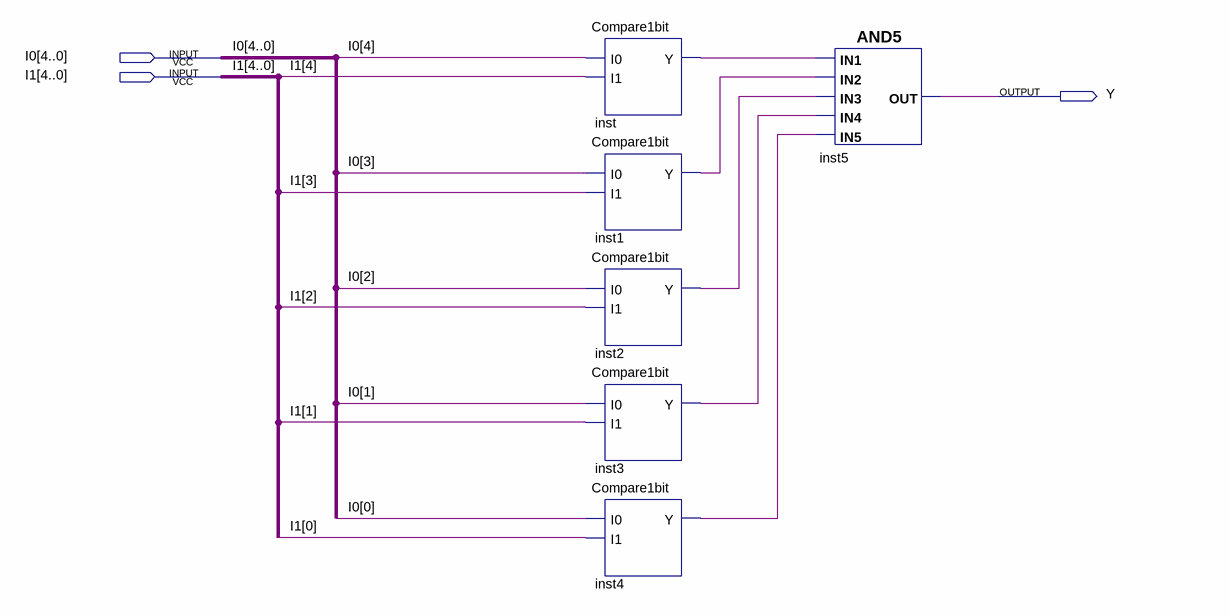
[diagram p0: schematic sheet]
// Quartus schematic Compare5bit.bdf as structural Verilog: 6 symbols, 3 pins
module Compare5bit (
  input  [4:0] I0,
  input  [4:0] I1,
  output Y
);

  wire inst1_y, inst2_y, inst3_y, inst4_y, inst_y;

  Compare1bit inst (.I0(I0[4]), .I1(I1[4]), .Y(inst_y));
  Compare1bit inst1 (.I0(I0[3]), .I1(I1[3]), .Y(inst1_y));
  Compare1bit inst2 (.I0(I0[2]), .I1(I1[2]), .Y(inst2_y));
  Compare1bit inst3 (.I0(I0[1]), .I1(I1[1]), .Y(inst3_y));
  Compare1bit inst4 (.I0(I0[0]), .I1(I1[0]), .Y(inst4_y));
  and inst5 (Y, inst_y, inst1_y, inst2_y, inst3_y, inst4_y);
endmodule
